# EasyEDA Pro project xiaozhi.epro

# Schematic Schematic1
Board Name: Board1; Create Date: 2025-10-13; Page Name: P1; Project Name: 小智礼物; Schematic Name: Schematic1; Update Date: 2025-10-15; Company: 嘉立创EDA; Page Size: A4; Version: V1.0
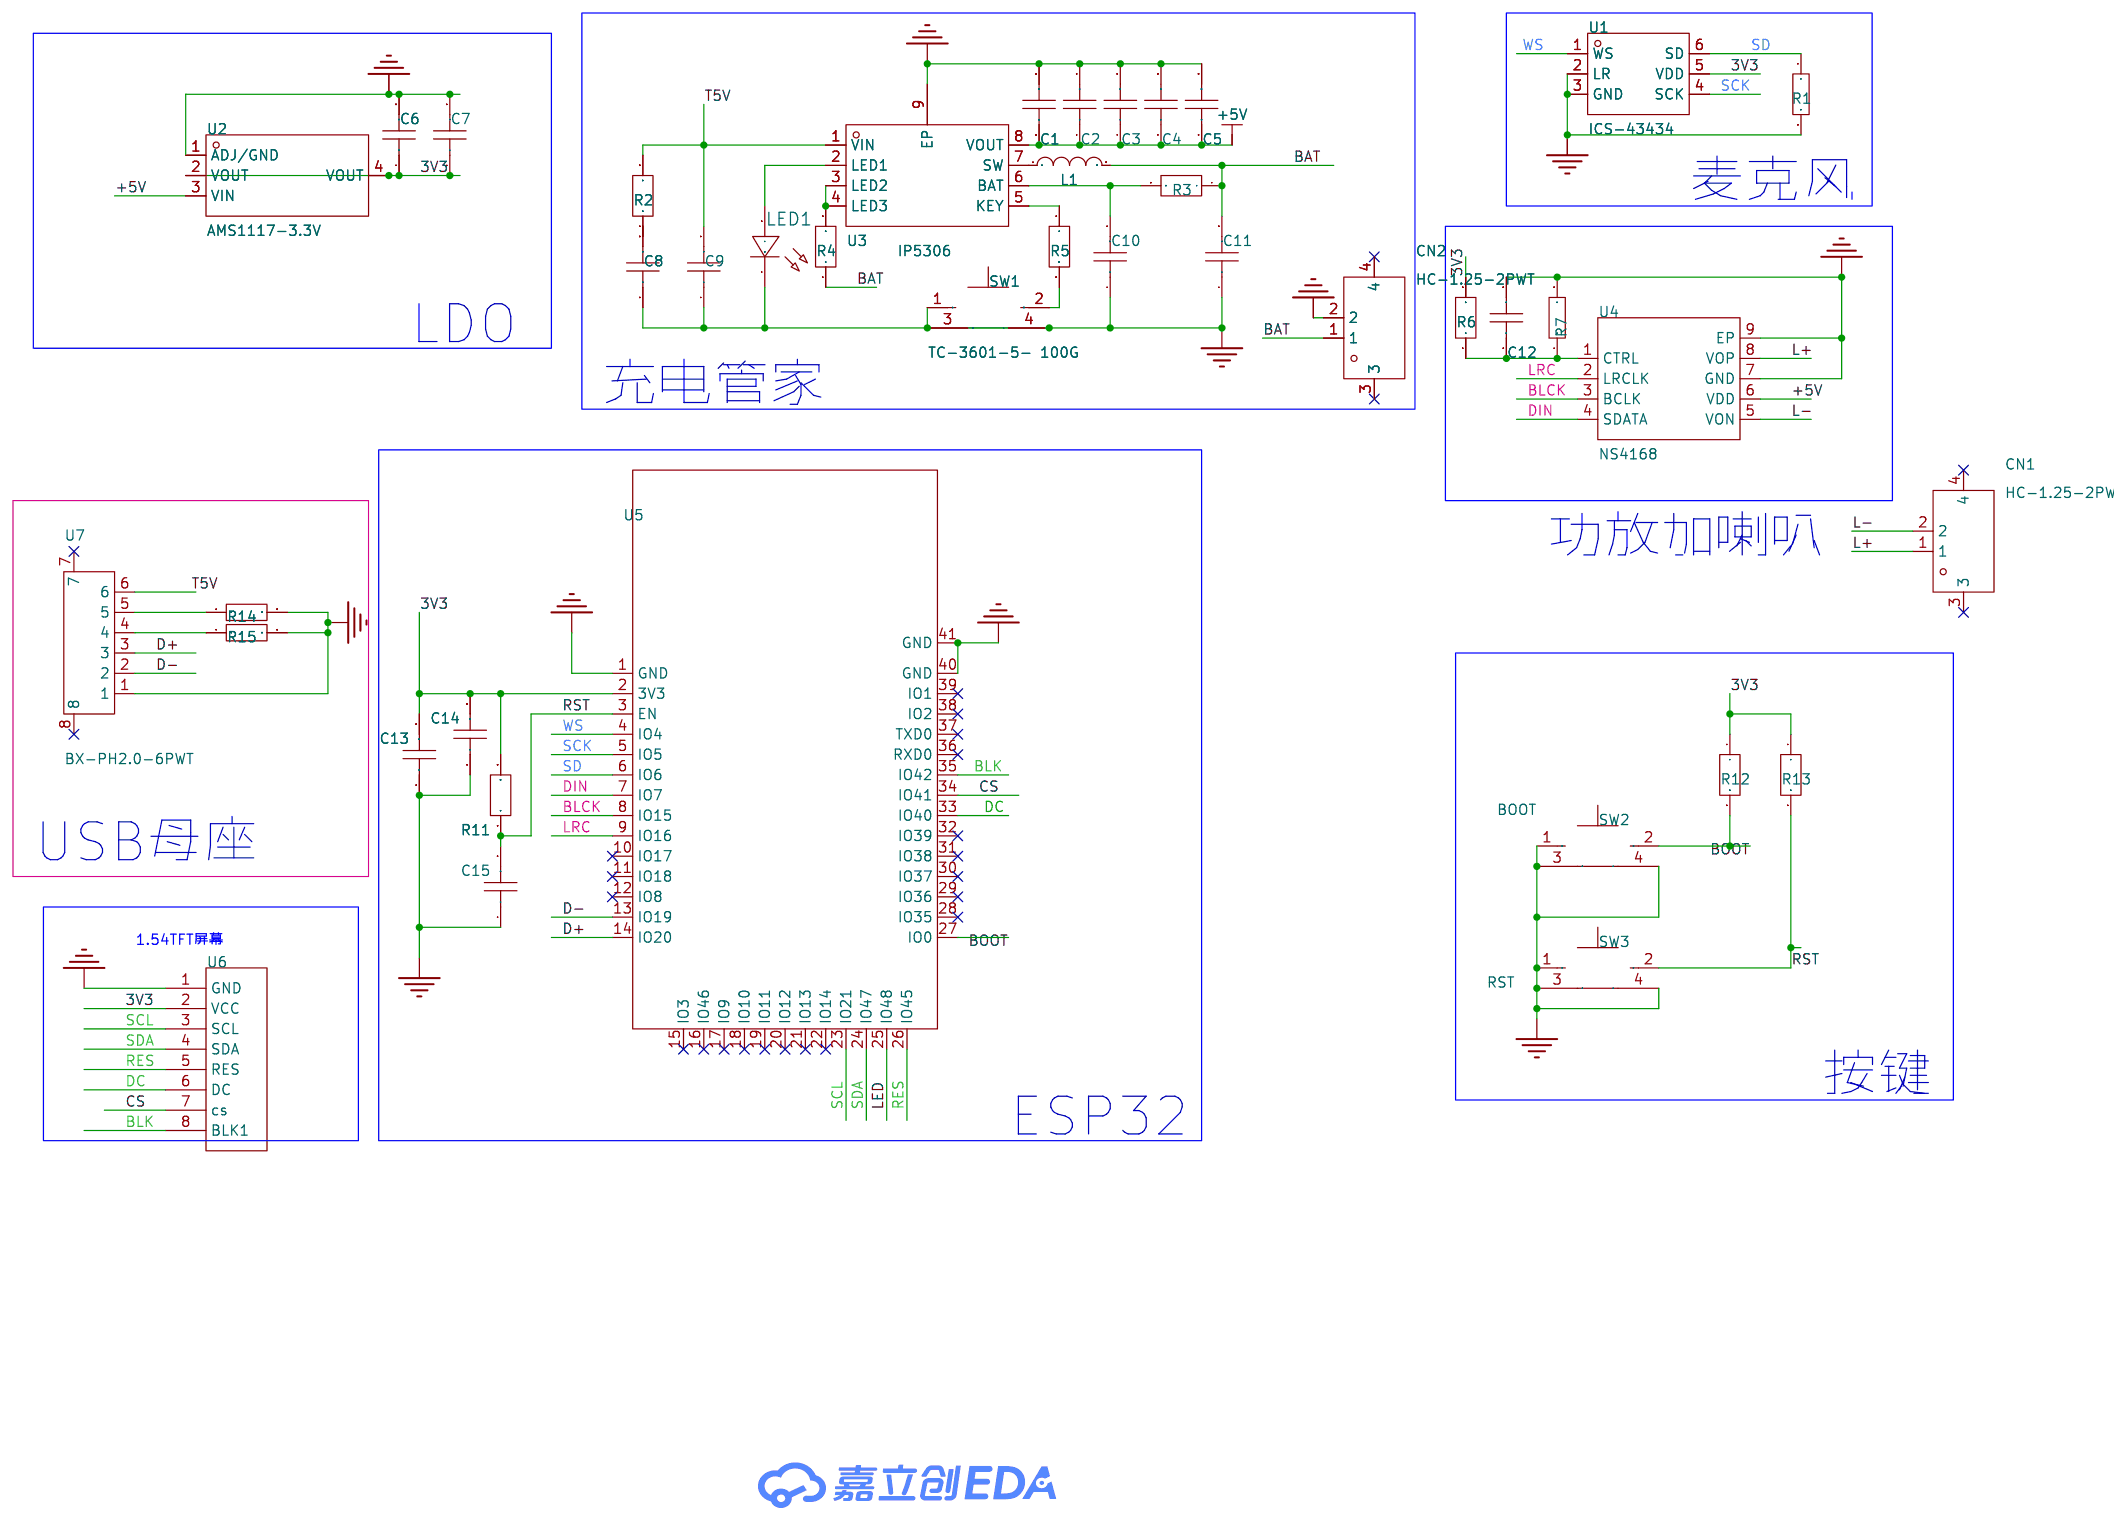
[diagram p0: schematic sheet]

## Parts
C1  22UF  [C0805]
C2  22UF  [C0805]
C3  22UF  [C0805]
C4  22UF  [C0805]
C5  22UF  [C0805]
C6  100NF  [C0805]
C7  10UF  [C0805]
C8  10uF  [C0805]
C9  10uF  [C0805]
C10  22UF  [C0805]
C11  22UF  [C0805]
C12  10UF  [C0805]
C13  10uF  [C0805]
C14  100nF  [C0805]
C15  1uF  [C0805]
CN1  HC-1.25-2PWT  [CONN-SMD_2P-P1.25-HC-1.25-2PWT]
CN2  HC-1.25-2PWT  [CONN-SMD_2P-P1.25-HC-1.25-2PWT]
L1  1uH  [IND-SMD_L4.4-W4.2]
LED1  -  [LED_0805]
R1  100K  [R0805]
R2  2R  [R0805]
R3  500mΩ  [R0805]
R4  1K  [R0805]
R5  10K  [R0805]
R6  10K  [R0805]
R7  5.1kΩ  [R0805]
R11  10K  [R0805]
R12  10K  [R0805]
R13  10K  [R0805]
R14  5.1kΩ  [R0805]
R15  5.1kΩ  [R0805]
SW1  TC-3601-5- 100G  [KEY-TH_TC-3601-5-100G_1]
SW2  BOOT  [KEY-TH_TC-3601-5-100G_1]
SW3  RST  [KEY-TH_TC-3601-5-100G_1]
U1  ICS-43434  [MIC-SMD_6P-L3.5-W2.7-P0.90-BL]
U2  AMS1117-3.3V  [SOT-223-4_L6.5-W3.5-P2.30-LS7.0-TR]
U3  IP5306  [ESOP-8_L4.9-W3.9-P1.27-LS6.0-BL-EP]
U4  NS4168  [ESOP-8_L4.9-W3.9-P1.27-LS6.0-BL-EP]
U5  ESP32-S3-WROOM-1-N16R8  [WIFIM-SMD_ESP32-S3-WROOM-1-N16R8]
U6  -  (no BOM)
U7  BX-PH2.0-6PWT  [CONN-SMD_6P-P2.00_MXPH-2.0-6P-WT1-0-A]

## Library data of the parts
C1-C7 C10-C12 = CAP_0805: Supplier Footprint: 0805
C8 C9 C13-C15 = CGA0805X5R106K250MT: 容值:10uF;精度:±10%;额定电压:25V;温度系数:X5R;; LCSC Part Name: 10uF ±10% 25V; Supplier Part: C6119887; Manufacturer: HRE(芯声); Supplier Footprint: 0805; JLCPCB Part Class: 扩展库; Supplier: LCSC; Tolerance: ±10%; Voltage Rating: 25V; Temperature Coefficient: X5R
CN1 CN2 = HC-1.25-2PWT: 插针结构:1x2P;间距:1.25mm;安装方式:卧贴;参考系列:PicoBlade(MX 1.25);总PIN数:2P;排数:1;每排PIN数:2;行距:-;额定电流:1A;触头材质:黄铜;触头镀层:锡;工作温度范围:-40℃~+105℃;; LCSC Part Name: 1x2P 间距:1.25mm 卧贴 系列:PicoBlade(MX 1.25); Supplier Part: C2845379; Manufacturer: HCTL(华灿天禄); Supplier Footprint: SMD,P=1.25mm,卧贴; JLCPCB Part Class: 扩展库; Datasheet: https://atta.szlcsc.com/upload/public/pdf/source/20240930/9508A8292CCC87B0C29E3A028D56E30A.pdf; Supplier: LCSC; Pins Structure: 1x2P; Pitch: 1.25mm; Mounting Style: 卧贴; Reference Series: PicoBlade(MX 1.25); Number of Pins: 2P; Number of Rows: 1; Number of PINs Per Row: 2; Current Rating (Max): 1A; Contact Material: 黄铜; Contact Plating: 锡; Operating Temperature Range: -40℃~+105℃; Rated Voltage (Max): 125V; Plastic Material: LCP; Flame Retardant Rating: UL94V-0; Supplementary Features: 辅助焊脚; Z-Height of the Board: 3.57mm; X-Length of Bottom Edge on Board (Spacing Line): 7.55mm; Y-Width of Bottom Edge on Board: 5.25mm
L1 = CXP0420-1ROM-AG(1uh): 电感值:1uH;精度:±20%;饱和电流(Isat):7A;类型:一体成型电感;; LCSC Part Name: 1uH ±20% 7A; Supplier Part: C7187305; Manufacturer: DMBJ(振宝佳); Supplier Footprint: SMD,4.2x4.4mm; JLCPCB Part Class: Extended Part; Datasheet: https://atta.szlcsc.com/upload/public/pdf/source/20230710/CFC2BBD551035D908F0C7CBC8304138F.pdf; Supplier: LCSC; Tolerance: ±20%; Saturation Current (Isat): 7A; Type: 一体成型电感
LED1 = LED_0805-R: Supplier Footprint: 0805
R1 = Res_0805: Supplier Footprint: 0805
R2-R6 R11-R13 = FRL0805JR500TS: 电阻类型:厚膜电阻;阻值:500mΩ;精度:±5%;功率:125mW;最大工作电压:300V;温度系数:±300ppm/℃;; LCSC Part Name: 500mΩ ±5% 125mW 厚膜电阻; Supplier Part: C2934281; Manufacturer: FOJAN(富捷); Supplier Footprint: 0805; JLCPCB Part Class: Extended Part; Datasheet: https://atta.szlcsc.com/upload/public/pdf/source/20211221/925EC7D7225764EE0046F22065062C87.pdf; Supplier: LCSC; Type: 厚膜电阻; Tolerance: ±5%; Power(Watts): 125mW; Overload Voltage (Max): 300V; Temperature Coefficient: ±300ppm/℃; Operating Temperature Range: -55℃~+155℃
R7 R14 R15 = 0805W8F5101T5E: 电阻类型:厚膜电阻;阻值:5.1kΩ;精度:±1%;功率:125mW;最大工作电压:150V;温度系数:±100ppm/℃;; LCSC Part Name: 5.1kΩ ±1% 125mW; Supplier Part: C27834; Manufacturer: UNI-ROYAL(厚声); Supplier Footprint: 0805; JLCPCB Part Class: 基础库; Datasheet: https://atta.szlcsc.com/upload/public/pdf/source/20200306/C422600_1E6D84923E4A46A82E41ADD87F860B5C.pdf; Supplier: LCSC; Type: 厚膜电阻; Tolerance: ±1%; Power(Watts): 125mW; Temperature Coefficient: ±100ppm/℃; Overload Voltage (Max): 150V; Operating Temperature Range: -55℃~+155℃
SW1-SW3 = TC-3601-5- 100G: 电路结构:单刀单掷;按钮形状:圆形按钮;作用力:100gf;安装方式:立贴;开关长度:3mm;开关宽度:6mm;开关高度:5mm;带支架:带支架;触点电流:50mA;额定电压(AC):-;额定电压(DC):12V;额定功率:-;绝缘电阻:-;带灯:-;机械寿命:10万次;; LCSC Part Name: 轻触3*6*5支架 插件100G; Supplier Part: C2845280; Manufacturer: HCTL(华灿天禄); Supplier Footprint: 插件; JLCPCB Part Class: 扩展库; Supplier: LCSC; Circuit: 单刀单掷; Actuator Style: 圆形按钮; Operating Force: 100gf; Mounting Style: 立贴; Switch Length: 3mm; Switch Width: 6mm; Switch Height: 5mm; Strike Gundam: 带支架; Contact Current: 50mA; Voltage Rating (DC): 12V; Actuator/Cap Color: 黑色; Pin Style: 鸥翼型; Mechanical Life: 10万次
U1 = ICS-43434_C5656610: 指向性:全指向;信噪比:64dB;灵敏度:-;; Supplier Part: C5656610; Manufacturer: TDK InvenSense(应美盛); JLCPCB Part Class: 扩展库; Datasheet: https://atta.szlcsc.com/upload/public/pdf/source/231023/DS-000069-ICS-43434-v1.2-8194c7772d771e21a553109502704f97.pdf; Supplier: LCSC; Direction: 全指向; Supply Voltage: 1.65V~3.63V; Current Consumption: 550uA; SNR(Signal to Noise Ratio): 64dB
U2 = AMS1117-3.3V_C5120765: 输出类型:固定;最大输入电压:18V;输出电压:3.3V;最大输出电流:1A;输出极性:正极;; LCSC Part Name: 输入18V 输出3.3V 1A; Supplier Part: C5120765; Manufacturer: MSKSEMI(美森科); Supplier Footprint: SOT-223; JLCPCB Part Class: 扩展库; Datasheet: https://atta.szlcsc.com/upload/public/pdf/source/20230802/7000FCAFF33971783A269E7BD69EFE08.pdf; Supplier: LCSC; Output Type: 固定; Maximum Input Voltage: 18V; Output Voltage: 3.3V; MAX Output Current: 1A; Dropout Voltage: 1.4V@(1A); standby current: 12mA; Operating Temperature: 0℃~+125℃; Output Polarity: 正极; Number of Outputs: 1
U3 = IP5306: 2.1A充电2.4A放电高集成度移动电源SOC; Supplier Part: C181692; Manufacturer: INJOINIC(英集芯); Supplier Footprint: ESOP-8; JLCPCB Part Class: 扩展库; Datasheet: https://atta.szlcsc.com/upload/public/pdf/source/20190627/C384572_9925B3DDC4041BC6108E5AB46A2A0AB1.pdf; Supplier: LCSC
U4 = NS4168_C910588: 功放类型:D类功放;输出功率:2.5Wx1@4Ω;; Supplier Part: C910588; Manufacturer: Nsiway(纳芯威); Supplier Footprint: ESOP-8-EP(3.9x4.9x1.27); JLCPCB Part Class: 扩展库; Datasheet: https://atta.szlcsc.com/upload/public/pdf/source/20240722/6A2F478F91F6E02E759B805C93276334.pdf; Supplier: LCSC; Class: D类功放; Output Power: 2.5Wx1@4Ω; Voltage - Supply: 3V~5.5V
U5 = ESP32-S3-WROOM-1-N16R8: LCSC Part Name: 通用型Wi-Fi+低功耗蓝牙MCU模组; Supplier Part: C2913202; Manufacturer: ESPRESSIF(乐鑫); Supplier Footprint: SMD,18x25.5mm; JLCPCB Part Class: Extended Part; Datasheet: https://atta.szlcsc.com/upload/public/pdf/source/20241030/6A412B13087E1327DF6279F5735253CA.pdf; Supplier: LCSC
U6 = TFT1.3液晶屏
U7 = BX-PH2.0-6PWT: 插针结构:1x6P;间距:2mm;安装方式:卧贴;参考系列:PH;总PIN数:6P;排数:1;每排PIN数:6;行距:-;额定电流:2A;触头材质:黄铜;触头镀层:锡;工作温度:-25℃~+85℃;; LCSC Part Name: 1x6P 间距:2mm 卧贴 系列:PH; Supplier Part: C18077894; Manufacturer: Bossie(博锡); Supplier Footprint: SMD,P=2mm,卧贴; JLCPCB Part Class: 扩展库; Datasheet: https://item.szlcsc.com/datasheet/BX-PH2.0-6PWT/19218295.html; Supplier: LCSC; Pins Structure: 1x6P; Pitch: 2mm; Mounting Type: 卧贴; Reference Series: PH; Number of Pins: 6P; Number of Rows: 1; Number of PINs Per Row: 6; Current Rating: 2A; Contact Material: 黄铜; Contact Plating: 锡; Operating Temperature: -25℃~+85℃; Voltage Rating: 250V; Plastic Material: LCP; Supplementary Features: 辅助焊脚; Color: 米色; Z-Height of the Board: 5.6mm; X-Length of Bottom Edge on Board (Spacing Line): 16mm; Y-Width of Bottom Edge on Board: 8.5mm

## Nets
3V3: C6.1 C7.1 C13.2 C14.2 R6.2 R11.2 R12.1 R13.1 U1.5(VDD) U2.2(VOUT) U2.4(VOUT) U5.2(3V3) U6.2(VCC)
+5V: C1.1 C2.1 C3.1 C4.1 C5.1 U2.3(VIN) U3.8(VOUT) U4.6(VDD)
GND: C1.2 C2.2 C3.2 C4.2 C5.2 C6.2 C7.2 C8.1 C9.1 C10.1 C11.1 C12.2 C13.1 C14.1 C15.1 CN2.2 LED1.1(C) R1.2 R7.2 R14.2 R15.2 SW1.1 SW1.3 SW1.4 SW2.1 SW2.3 SW2.4 SW3.1 SW3.3 SW3.4 U1.2(LR) U1.3(GND) U2.1(ADJ/GND) U3.9(EP) U4.7(GND) U4.9(EP) U5.1(GND) U5.40(GND) U5.41(GND) U6.1(GND) U7.1
BAT: C11.2 CN2.1 L1.2 R3.1 R4.1
BLCK: U4.3(BCLK) U5.8(IO15)
BLK: U5.35(IO42) U6.8(BLK1)
BOOT: R12.2 SW2.2 U5.27(IO0)
CS: U5.34(IO41) U6.7(cs)
D+: U5.14(IO20) U7.3
D-: U5.13(IO19) U7.2
DC: U5.33(IO40) U6.6(DC)
DIN: U4.4(SDATA) U5.7(IO7)
L+: CN1.1 U4.8(VOP)
L-: CN1.2 U4.5(VON)
LED: U5.25(IO48)
LRC: U4.2(LRCLK) U5.9(IO16)
RES: U5.26(IO45) U6.5(RES)
RST: C15.2 R11.1 R13.2 SW3.2 U5.3(EN)
SCK: U1.4(SCK) U5.5(IO5)
SCL: U5.23(IO21) U6.3(SCL)
SD: R1.1 U1.6(SD) U5.6(IO6)
SDA: U5.24(IO47) U6.4(SDA)
T5V: C9.2 R2.2 U3.1(VIN) U7.6
WS: U1.1(WS) U5.4(IO4)
$1N1653: LED1.2(A) U3.2(LED1)
$1N1654: L1.1 U3.7(SW)
$1N1684: C12.1 R6.1 R7.1 U4.1(CTRL)
$1N1700: R5.1 U3.5(KEY)
$1N1704: C10.2 R3.2 U3.6(BAT)
$1N1708: C8.2 R2.1
$1N1732: R4.2 U3.3(LED2) U3.4(LED3)
$1N1735: R5.2 SW1.2
$1N6727: R14.1 U7.5
$1N6731: R15.1 U7.4

Not connected (* = marked no-connect by the designer): CN1 3* 4*; CN2 3* 4*; U5 10(IO17)* 11(IO18)* 12(IO8)* 15(IO3)* 16(IO46)* 17(IO9)* 18(IO10)* 19(IO11)* 20(IO12)* 21(IO13)* 22(IO14)* 28(IO35)* 29(IO36)* 30(IO37)* 31(IO38)* 32(IO39)* 36(RXD0)* 37(TXD0)* 38(IO2)* 39(IO1)*; U7 7* 8*

## Notes on the sheet
- 麦克风
- LDO
- 充电管家
- 功放加喇叭
- USB母座
- 1.54TFT屏幕
- 按键
- ESP32

# Board PCB1
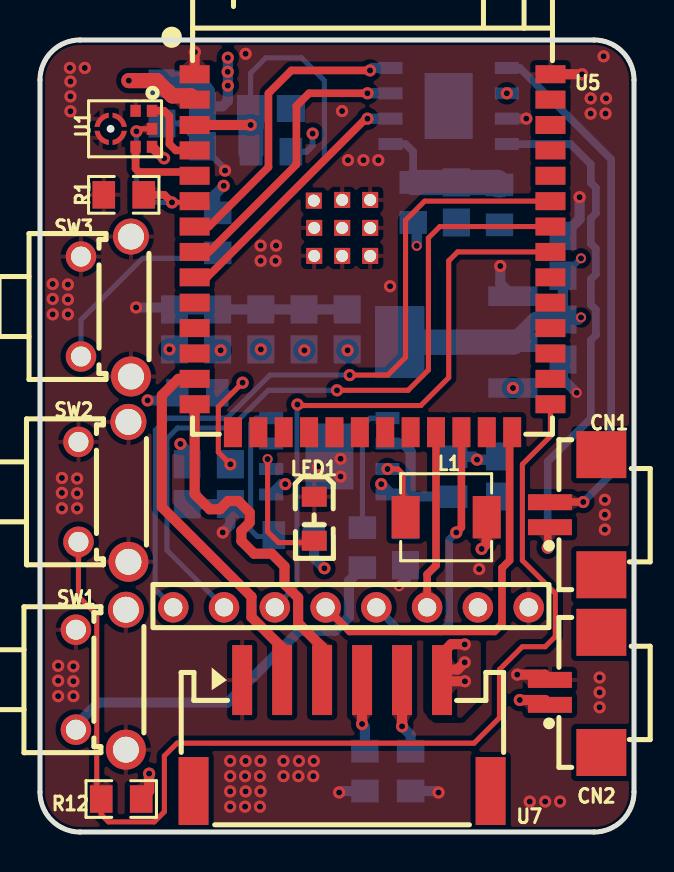
[diagram p1: board, top side]
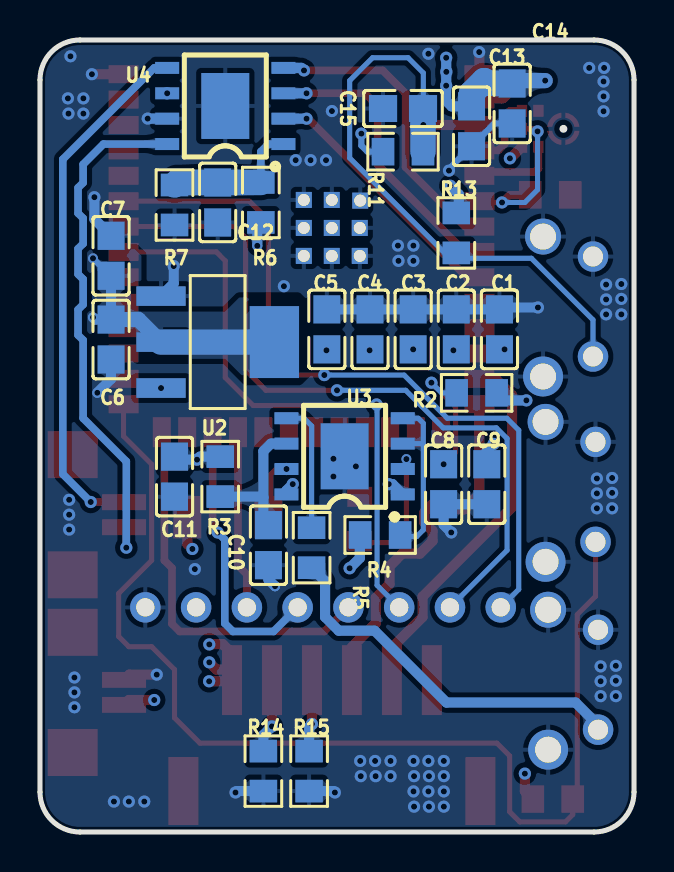
[diagram p2: board, bottom side, seen from below]

Outline 29.72 x 39.62 mm; copper layers: Top Layer, Inner1, 内层2, Bottom Layer. Coordinates in mm from the lower left corner of the outline.
Outline path: 0,37.62 0,2 arc(0.59,0.59) 2,0 27.72,0 arc(29.13,0.59) 29.72,2 29.72,37.62 arc(29.13,39.04) 27.72,39.62 2,39.62 arc(0.59,39.04) 0,37.62
Stack: Top Layer 0.035mm 外层铜厚1oz / Dielectric1 0.2104mm 7628 RC49% 8.6mil / Inner1 0.0152mm 内层铜厚 / Dielectric2 1.065mm 1.1mm H/HOZ Copper / 内层2 0.0152mm 内层铜厚 / Dielectric3 0.2104mm 7628 RC49% 8.6mil / Bottom Layer 0.035mm 外层铜厚1oz

## Design rules (mm)
net L-: DP1
net L+: DP1
net D-: DP2
net D+: DP2
template: 自定义配置
spacing copperThickness1oz (default): track to track 0.102, other pairs 0.152 to 0.3
spacing copperThickness2oz: track to track 0.203, other pairs 0.152 to 0.3
track width copperThickness1oz (default): min 0.127, default 0.254, max 2.54
track width copperThickness2oz: min 0.203, default 0.254, max 2.54
differential pair differentialPair (default): width min 0.127, default 0.254, max 2.54; gap min 0.152, default 0.152
via viaSize (default): diameter min 0.5, default 0.61, max 10; hole min 0.3, default 0.305, max 6.3

## Placement (name value [footprint] x y rotation side)
C1  22UF  [C0805]  6.73 25.15 90 bottom
C2  22UF  [C0805]  8.89 25.15 90 bottom
C3  22UF  [C0805]  11.05 25.15 90 bottom
C4  22UF  [C0805]  13.21 25.15 90 bottom
C5  22UF  [C0805]  15.37 25.15 90 bottom
C6  100NF  [C0805]  26.16 24.64 270 bottom
C7  10UF  [C0805]  26.16 28.83 90 bottom
C8  10uF  [C0805]  9.53 17.4 90 bottom
C9  10uF  [C0805]  7.37 17.4 90 bottom
C10  22UF  [C0805]  18.29 14.35 90 bottom
C11  22UF  [C0805]  22.99 17.78 90 bottom
C12  10UF  [C0805]  20.83 31.5 270 bottom
C13  10uF  [C0805]  8.13 35.31 90 bottom
C14  100nF  [C0805]  6.1 36.45 90 bottom
C15  1uF  [C0805]  11.56 36.19 180 bottom
CN1  HC-1.25-2PWT  [CONN-SMD_2P-P1.25-HC-1.25-2PWT]  26.8 15.88 90 top
CN2  HC-1.25-2PWT  [CONN-SMD_2P-P1.25-HC-1.25-2PWT]  26.8 6.98 90 top
L1  1uH  [IND-SMD_L4.4-W4.2]  20.32 15.75 180 top
LED1  -  [LED_0805]  13.72 15.62 270 top
NOREF  -  [Pad_e56]  21.91 11.24 180 top
NOREF#2  -  [Pad_e61]  9.21 11.24 180 top
NOREF#3  -  [Pad_e59]  14.29 11.24 180 top
NOREF#4  -  [Pad_e60]  11.75 11.24 180 top
NOREF#5  -  [Pad_e55]  24.45 11.24 180 top
NOREF#6  -  [Pad_e62]  6.67 11.24 180 top
NOREF#7  -  [Pad_e57]  19.37 11.24 180 top
NOREF#8  -  [Pad_e58]  16.83 11.24 180 top
R1  100K  [R0805]  4.19 31.88 180 top
R2  2R  [R0805]  7.87 21.97 180 bottom
R3  500mΩ  [R0805]  20.7 17.78 270 bottom
R4  1K  [R0805]  12.7 14.86 180 bottom
R5  10K  [R0805]  16.13 14.22 270 bottom
R6  10K  [R0805]  18.67 31.5 270 bottom
R7  5.1kΩ  [R0805]  22.99 31.37 270 bottom
R11  10K  [R0805]  11.56 34.04 0 bottom
R12  10K  [R0805]  4.06 1.65 180 top
R13  10K  [R0805]  8.89 29.97 270 bottom
R14  5.1kΩ  [R0805]  18.54 3.05 270 bottom
R15  5.1kΩ  [R0805]  16.26 3.05 270 bottom
SW1  TC-3601-5- 100G  [KEY-TH_TC-3601-5-100G_1]  3.05 7.62 270 top
SW2  BOOT  [KEY-TH_TC-3601-5-100G_1]  3.18 17.02 270 top
SW3  RST  [KEY-TH_TC-3601-5-100G_1]  3.3 26.29 270 top
U1  ICS-43434  [MIC-SMD_6P-L3.5-W2.7-P0.90-BL]  4.32 35.18 180 top
U2  AMS1117-3.3V  [SOT-223-4_L6.5-W3.5-P2.30-LS7.0-TR]  20.83 24.51 270 bottom
U3  IP5306  [ESOP-8_L4.9-W3.9-P1.27-LS6.0-BL-EP]  14.48 18.8 90 bottom
U4  NS4168  [ESOP-8_L4.9-W3.9-P1.27-LS6.0-BL-EP]  20.45 36.32 90 bottom
U5  ESP32-S3-WROOM-1-N16R8  [WIFIM-SMD_ESP32-S3-WROOM-1-N16R8]  16.64 28.96 0 top
U7  BX-PH2.0-6PWT  [CONN-SMD_6P-P2.00_MXPH-2.0-6P-WT1-0-A]  15.11 4.83 0 top

## Footprints (pads in the part's own frame, mm; a bottom-side part is the same pattern mirrored in y, then rotated)
C0805
  rect 1.41x1.35 smd: 1(-1,0) 2(1,0)
CONN-SMD_2P-P1.25-HC-1.25-2PWT
  rect 0.8x2.2 smd: 1(-0.625,1.285) 2(0.625,1.285)
  rect 2.35x2.5 smd: 3(-3.005,-1.285) 4(3.005,-1.285)
CONN-SMD_6P-P2.00_MXPH-2.0-6P-WT1-0-A
  rect 1x3.5 smd: 1(-5,2.775) 2(-3,2.775) 3(-1,2.775) 4(1,2.775) 5(3,2.775) 6(5,2.775)
  rect 1.5x3.4 smd: 7(7.43,-2.775) 8(-7.43,-2.775)
ESOP-8_L4.9-W3.9-P1.27-LS6.0-BL-EP
  rect 0.6x1.2 smd: 1(-1.905,-2.909) 2(-0.635,-2.909) 3(0.635,-2.909) 4(1.905,-2.909) 5(1.905,2.909) 6(0.635,2.909) 7(-0.635,2.909) 8(-1.905,2.909)
  rect 3.3x2.4 smd: 9(0,0)
IND-SMD_L4.4-W4.2
  rect 1.4x2.12 smd: 1(2.028,0) 2(-2.028,0)
KEY-TH_TC-3601-5-100G_1
  round 1.524 hole 1: 1(-2.5,-1.25) 2(2.5,-1.25)
  round 1.8 hole 1.3: 3(-3.5,1.25)
  round 2 hole 1.3: 4(3.5,1.25)
LED_0805
  rect 1x1.25 smd: 1(-1.15,0.005) 2(1.05,0.005)
MIC-SMD_6P-L3.5-W2.7-P0.90-BL
  rect 0.52x0.6 smd: 1(-1.286,-0.9) 2(-0.465,-0.9) 4(-0.465,0.9) 5(-1.286,0.9) 6(-1.286,0)
  custom 0.709x0.71 smd: 3(0.276,-0.452) 3(0.329,0.505) 3(1.234,-0.505) 3(1.286,0.452)
Pad_e55
  round 1.524 hole 0.914: 1(0,0)
Pad_e56
  round 1.524 hole 0.914: 2(0,0)
Pad_e57
  round 1.524 hole 0.914: 3(0,0)
Pad_e58
  round 1.524 hole 0.914: 4(0,0)
Pad_e59
  round 1.524 hole 0.914: 5(0,0)
Pad_e60
  round 1.524 hole 0.914: 6(0,0)
Pad_e61
  round 1.524 hole 0.914: 7(0,0)
Pad_e62
  round 1.524 hole 0.914: 8(0,0)
R0805
  rect 1.133x1.377 smd: 1(-1,0) 2(1,0)
SOT-223-4_L6.5-W3.5-P2.30-LS7.0-TR
  rect 0.98x2.47 smd: 1(-2.3,-2.835) 2(0,-2.835) 3(2.3,-2.835)
  rect 3.6x2.47 smd: 4(0,2.835)
WIFIM-SMD_ESP32-S3-WROOM-1-N16R8
  rect 1.5x0.9 smd: 1(-8.9,8.954) 2(-8.9,7.684) 3(-8.9,6.415) 4(-8.9,5.144) 5(-8.9,3.874) 6(-8.9,2.604) 7(-8.9,1.335) 8(-8.9,0.065) 9(-8.9,-1.206) 10(-8.9,-2.475) 11(-8.9,-3.745) 12(-8.9,-5.016) 13(-8.9,-6.285) 14(-8.9,-7.556) 27(8.9,-7.556) 28(8.9,-6.285) 29(8.9,-5.016) 30(8.9,-3.745) 31(8.9,-2.475) 32(8.9,-1.206) 33(8.9,0.065) 34(8.9,1.335) 35(8.9,2.604) 36(8.9,3.874) 37(8.9,5.144) 38(8.9,6.415) 39(8.9,7.684) 40(8.9,8.954)
  rect 0.9x1.5 smd: 15(-6.985,-8.954) 16(-5.715,-8.954) 17(-4.445,-8.954) 18(-3.175,-8.954) 19(-1.905,-8.954) 20(-0.635,-8.954) 21(0.635,-8.954) 22(1.905,-8.954) 23(3.175,-8.954) 24(4.445,-8.954) 25(5.715,-8.954) 26(6.985,-8.954)
  rect 0.8x0.8 hole 0.6: 41(-2.939,2.631) 41(-2.918,1.266) 41(-2.918,-0.135) 41(-1.518,2.666) 41(-1.518,1.266) 41(-1.518,-0.135) 41(-0.118,2.666) 41(-0.118,1.266) 41(-0.118,-0.135)

## Nets
3V3: C6.1 C7.1 C13.2 C14.2 NOREF.2 R6.2 R11.2 R12.1 R13.1 U1.5 U2.2 U2.4 U5.2
+5V: C1.1 C2.1 C3.1 C4.1 C5.1 U2.3 U3.8 U4.6
GND: C1.2 C2.2 C3.2 C4.2 C5.2 C6.2 C7.2 C8.1 C9.1 C10.1 C11.1 C12.2 C13.1 C14.1 C15.1 CN2.2 LED1.1 NOREF#5.1 R1.2 R7.2 R14.2 R15.2 SW1.1 SW1.3 SW1.4 SW2.1 SW2.3 SW2.4 SW3.1 SW3.3 SW3.4 U1.2 U1.3 U2.1 U3.9 U4.7 U4.9 U5.1 U5.40 U5.41 U7.1
BAT: C11.2 CN2.1 L1.2 R3.1 R4.1
BLCK: U4.3 U5.8
BLK: NOREF#6.8 U5.35
BOOT: R12.2 SW2.2 U5.27
CS: NOREF#2.7 U5.34
D+: U5.14 U7.3
D-: U5.13 U7.2
DC: NOREF#4.6 U5.33
DIN: U4.4 U5.7
L+: CN1.1 U4.8
L-: CN1.2 U4.5
LED: U5.25
LRC: U4.2 U5.9
RES: NOREF#3.5 U5.26
RST: C15.2 R11.1 R13.2 SW3.2 U5.3
SCK: U1.4 U5.5
SCL: NOREF#7.3 U5.23
SD: R1.1 U1.6 U5.6
SDA: NOREF#8.4 U5.24
T5V: C9.2 R2.2 U3.1 U7.6
WS: U1.1 U5.4
$1N1653: LED1.2 U3.2
$1N1654: L1.1 U3.7
$1N1684: C12.1 R6.1 R7.1 U4.1
$1N1700: R5.1 U3.5
$1N1704: C10.2 R3.2 U3.6
$1N1708: C8.2 R2.1
$1N1732: R4.2 U3.3 U3.4
$1N1735: R5.2 SW1.2
$1N6727: R14.1 U7.5
$1N6731: R15.1 U7.4

Pads without a net: CN1 3 4; CN2 3 4; U5 10 11 12 15 16 17 18 19 20 21 22 28 29 30 31 32 36 37 38 39; U7 7 8

## Via types
v1: diameter 0.61, hole 0.305, Top Layer to Bottom Layer, 123 vias
v2: diameter 0.5, hole 0.3, Top Layer to Bottom Layer, 2 vias
v3: diameter 0.5, hole 0.305, Top Layer to Bottom Layer, 4 vias

## Routing (per net, layer and track width the routed paths; a pad name or vN(x,y) marks a point on that pad's centre or on a via; arc(x,y) is an arc through that point)
3V3: length 31.8
  Top Layer w0.508: U1.5 6.15,33.73 ; R12.1 5.46,2.05 v1(5.46,2.92)
  Top Layer w0.762: v1(4.45,37.59) 5.84,37.59 6.37,37.06 6.38,37.06 6.61,36.83 7.55,36.83 7.74,36.64
  Bottom Layer w0.305: R11.2 13.34,34.04 13.64,34.34 v1(13.64,34.94) ; v3(27.07,28.7) 26.19,27.83 C7.1
  Bottom Layer w0.508: C7.1 C6.1 26.96,25.64 v3(27.07,25.74) ; C13.2 9.13,36.31 9.4,36.58 v1(9.4,37.34) v1(9.4,38.73) ; v1(9.19,32.33) 8.76,31.9 8.76,31.1 R13.1 ; v3(18.85,29.33) 18.85,30.32 R6.2
  Bottom Layer w0.762: v1(4.45,37.59) 5.95,37.59 C14.2 ; U2.2 24.79,25.64 C6.1
  Bottom Layer w1.27: C13.2 8.13,36.96 7.49,37.59 7.36,37.46 6.09,37.46 ; U2.4 U2.2
  vias: v1(6.21,33.7) v1(9.39,38.03)
+5V: length 0.6
  Bottom Layer w0.508: v1(17.07,17.4) 17.39,17.09 U3.8
  vias: v1(6.48,24.15) v1(9.04,24.1) v1(11.05,24.15) v1(13.23,24.1) v1(15.39,24.1) v1(23.36,36.96) v1(23.66,22.21)
GND: length 33.9
  Top Layer w0.508: U5.40 v1(27.12,37.91) ; U5.1 7.74,39.01 v1(7.75,39.02) ; CN2.2 25.25,7.87 v1(23.88,7.87)
  Bottom Layer w0.305: v1(9.26,33.09) 9.26,33.18 C13.1 6.99,35.45 C14.1
  Bottom Layer w0.508: v2(26.85,21.97) 26.16,22.66 C6.2 ; v1(4.81,26.24) 6.64,26.24 C1.2 C2.2 C3.2 C4.2 C5.2 ; v1(9.14,14.99) 9.53,15.37 C8.1 C9.1 ; v1(14.97,1.98) 15.04,2.05 R15.2 ; v1(19.94,1.98) 19.87,2.05 R14.2 ; v1(24.33,35.69) 24.33,35.69 U4.7 ; v1(27,31.76) 27,30.66 C7.2 ; v1(23.03,28.31) 23.03,27.45 U2.1 ; v2(17.96,12.3) 18.29,12.62 C10.1
  vias: v1(0.64,27.42) v1(0.64,26.67) v1(0.64,25.9) v1(0.91,8.31) v1(0.91,7.57) v1(0.91,6.8) v1(1.1,17.71) v1(1.1,16.97) v1(1.1,16.19) v1(1.4,27.39) v1(1.4,26.64) v1(1.4,25.9) v1(1.5,38.23) v1(1.52,37.55) v1(1.52,36.8) v1(1.52,36.06) v1(1.67,8.29) v1(1.67,7.54) v1(1.67,6.8) v1(1.86,17.69) v1(1.86,16.94) v1(1.86,16.19) v1(2.24,38.23) v1(9.51,3.56) v1(9.51,2.79) v1(9.51,2.03) v1(9.51,1.27) v1(10.26,2.79) v1(10.26,1.27) v1(10.29,38.93) v1(10.29,3.56) v1(10.29,2.03) v1(11.04,29.34) v1(11.04,28.58) v1(11.03,3.56) v1(11,2.79) v1(11.03,2.03) v1(11,1.27) v1(11.81,29.34) v1(11.78,28.58) v1(12.18,3.56) v1(12.18,2.79) v1(12.95,3.56) v1(12.93,2.79) v1(13.67,2.79) v1(13.7,3.56) v1(13.92,18.29) v1(15.04,18.67) v1(15.04,17.78) v1(15.11,36.07) v1(15.41,33.61) v1(16.18,33.61) v1(16.93,33.61) v1(17.52,27.3) v1(21.97,13.15) v1(24.5,1.52) v1(25.27,1.52) v1(26.02,1.52) v1(27.55,36.7) v1(27.55,35.94) v1(28,7.73) v1(28,6.98) v1(28,6.24) v1(28.19,38.81) v1(28.26,16.62) v1(28.26,15.88) v1(28.26,15.13) v1(28.32,36.7) v1(28.29,35.94)
BAT: length 7.6
  Top Layer w0.508: CN2.1 25.27,6.6 v1(24,6.6) ; v1(22.09,14.16) 22.35,14.42 L1.2
  Bottom Layer w0.508: R3.1 21.71,18.78 v1(21.86,18.63) 22.84,18.63 C11.2 ; v1(14.23,13.19) 13.72,13.71 13.72,14.84 R4.1
BLCK: length 14.8
  Top Layer w0.381: U5.8 8.46,29.02 12.83,33.39 12.83,36.32 13.46,36.96 v1(16.38,36.96)
  Bottom Layer w0.508: v1(16.38,36.96) 17.54,36.96
BLK: length 37.8
  Top Layer w0.254: U5.35 19.24,31.56 18.29,30.61 18.29,23.75 17.4,22.86 v1(15.49,22.86)
  Bottom Layer w0.254: NOREF#6.8 5.77,12.14 5.77,20.1 6.37,20.7 9.34,20.7 11.5,22.86 v1(15.49,22.86)
BOOT: length 56.8
  Top Layer w0.254: SW2.2 1.93,11.79 2.84,10.88 2.84,1.88 R12.2 3.06,0.87 3.43,0.51 5.72,0.51 6.22,1.02 6.22,3.81 6.86,4.44 21.72,4.44 22.99,5.72 22.99,8.13 24.13,9.27 25.27,9.27 25.78,9.78 25.78,11.94 24.13,13.59 24.13,18.4 25.54,19.8 U5.27
CS: length 37.1
  Top Layer w0.254: v1(14.86,22.1) 18.42,22.1 19.43,23.11 19.43,29.72 20,30.29 U5.34
  Bottom Layer w0.254: NOREF#2.7 6.35,14.1 6.35,19.69 6.88,20.22 9.54,20.22 11.42,22.1 v1(14.86,22.1)
D+: length 18.7
  Top Layer w0.508: U5.14 7.74,16.9 8.49,16.15 9,16.15 9.41,16.56 9.92,16.56 10.49,15.99 10.49,15.48 10.08,15.07 10.08,14.56 10.71,13.92 11.6,13.92 12.23,13.29 12.23,12.41 12.92,11.72 12.92,10.45 14.11,9.25 U7.3
D-: length 18.7
  Top Layer w0.508: U7.2 12.11,9.22 10.58,10.76 10.58,11.77 6.1,16.26 6.1,21.84 6.92,22.67 U5.13
DC: length 29.9
  Top Layer w0.254: U5.33 20.89,29.02 20.45,28.58 20.45,22.73 19.05,21.34 12.93,21.34 v1(12.88,21.39)
  Bottom Layer w0.254: NOREF#4.6 12.85,12.35 12.85,21.36 v1(12.88,21.39)
DIN: length 15.3
  Top Layer w0.381: v1(16.51,38.1) 12.57,38.1 11.43,36.96 11.43,33.27 8.46,30.29 U5.7
  Bottom Layer w0.508: U4.4 16.64,38.23 v1(16.51,38.1)
L+: length 26.4
  Top Layer w0.381: CN1.1 25.4,15.14 v1(25.4,14.22)
  Bottom Layer w0.381: v1(25.4,14.22) 25.4,18.54 27.56,20.7 27.56,24.61 27.81,24.86 27.81,26.13 27.56,26.39 27.56,27.66 27.81,27.91 27.81,29.18 27.56,29.43 27.56,30.7 27.81,30.96 27.81,32.23 27.56,32.48 27.56,33.4 26.54,34.42 U4.8
L-: length 26.5
  Top Layer w0.381: CN1.2 25.52,16.51 v1(27.18,16.51)
  Bottom Layer w0.381: U4.5 24,38.23 28.58,33.66 28.58,17.91 v1(27.18,16.51)
LRC: length 13.1
  Top Layer w0.381: v1(16.38,35.69) 16.3,35.69 8.36,27.75 U5.9
  Bottom Layer w0.508: v1(16.38,35.69) U4.2
RES: length 19.3
  Top Layer w0.381: U5.26 23.5,19.87 23.5,13.59 23.11,13.21 23.11,10.41 22.73,10.03 15.49,10.03 NOREF#3.5
RST: length 32.6
  Top Layer w0.508: U5.3 v1(10.54,35.37)
  Bottom Layer w0.254: C15.2 10.54,36.21 10.54,37.97 11.3,38.73 13.08,38.73 14.22,37.59 14.22,33.72 9.48,28.97 R13.2 8.62,28.7 5.13,28.7 2.05,25.62 SW3.2 ; 10.67,35.24 10.56,35.35
  Bottom Layer w0.508: 10.56,35.35 v1(10.54,35.37)
  Bottom Layer w1.27: C15.2 R11.1
SCK: length 4.2
  Top Layer w0.381: U5.5 7.55,33.02 4.95,33.02 4.78,33.19 U1.4
SCL: length 8.9
  Top Layer w0.381: NOREF#7.3 19.37,12.89 19.81,13.33 19.81,20
SD: length 8.5
  Top Layer w0.254: v1(6.6,31.5) 7.67,31.5 U5.6 ; v1(4.83,35.05) 4.95,35.18 U1.6
  Top Layer w0.381: R1.1 6.22,31.88 v1(6.6,31.5)
  Bottom Layer w0.254: v1(4.83,35.05) 4.83,32.13 5.46,31.5 v1(6.6,31.5)
SDA: length 14.1
  Top Layer w0.381: v1(20.83,14.99) 21.08,15.24 U5.24
  Bottom Layer w0.381: v1(20.83,14.99) 20.47,14.63 20.47,10.44 20.07,10.03 18.03,10.03 NOREF#8.4
T5V: length 8.6
  Top Layer w0.508: v1(21.25,8.49) 20.89,8.13 20.34,8.13 20.11,7.9 20.11,8.94 20.57,9.4 21.24,9.4 v1(21.25,9.39) ; v1(21.26,7.54) 20.17,7.54 U7.6
  Bottom Layer w0.508: v1(7.03,19.42) 7.37,19.08 C9.2 ; R2.2 6.5,21.59 v1(5.39,21.59) ; U3.1 12.08,17.4 v1(12.27,17.4)
WS: length 3.8
  Top Layer w0.381: U1.1 6.21,36.08 6.48,35.81 6.48,34.42 6.79,34.1 U5.4
$1N1653: length 6.8
  Top Layer w0.254: v3(11.39,18.66) 11.39,15.03 11.94,14.48 13.63,14.48 LED1.2
  Bottom Layer w0.254: U3.2 11.39,18.34 v3(11.39,18.66)
$1N1654: length 3.1
  Top Layer w0.254: v1(17.39,18.16) 17.91,18.16 18.16,17.91 18.16,15.88 L1.1
$1N1684: length 7.2
  Bottom Layer w0.381: U4.1 18.29,34.42 18.67,34.04 R6.1
  Bottom Layer w1.27: R7.1 22.86,32.5 C12.1 R6.1
$1N1700: length 6.5
  Bottom Layer w0.254: 17.39,20.7 16.51,20.7 16.13,20.32 R5.1
$1N1704: length 7.3
  Bottom Layer w0.508: R3.2 18.58,16.78 18.54,16.74 ; U3.6 18.16,19.43 18.54,19.05 18.54,16.74 ; 18.54,16.74 18.54,15.61 C10.2
$1N1708: length 6.3
  Top Layer w0.254: v1(10.14,22.48) 8.92,21.27 8.92,19 v1(9.53,18.4)
  Bottom Layer w0.254: v1(10.14,22.48) 9.63,21.97 R2.1
$1N1732: length 8.8
  Bottom Layer w0.254: U3.3 10.57,19.43 10.54,19.4 ; 10.54,19.4 10.54,20.45 10.8,20.7 11.57,20.7 ; 10.54,19.4 10.54,15.11 10.87,14.78 11.63,14.78 R4.2
$1N1735: length 18.9
  Bottom Layer w0.508: SW1.2 1.8,5.35 2.92,6.48 9.38,6.48 12.98,10.07 14.77,10.07 15.46,10.76 15.46,12.55 R5.2
$1N6727: length 3.7
  Top Layer w0.508: U7.5 v1(18.11,5.28)
  Bottom Layer w0.508: v1(18.11,5.28) 18.54,4.86 R14.1
$1N6731: length 3.6
  Top Layer w0.508: U7.4 v1(16.11,5.4)
  Bottom Layer w0.508: v1(16.11,5.4) 16.26,5.26 R15.1

## Copper pours and planes (outline as drawn; the poured copper is in the pictures)
3V3 on Bottom Layer: 24.64,26.03 20.46,26.03 19.75,26.74 16.84,26.74 16.38,26.29 16.38,22.99 16.76,22.61 19.38,22.61 20.45,23.67 24.82,23.67 25.21,24.07 25.21,24.45 25.53,24.77 27.31,24.77 27.94,25.4 27.94,28.66 27.34,29.15 24.95,29.15 24.64,28.84
3V3 on 内层2: 0.26,39.37 29.46,39.37 29.46,0.26 0.26,0.26
+5V on 内层2: 5.33,37.27 25.22,37.27 25.22,16.67 5.33,16.67
GND on Top Layer: -3.3,46.36 33.4,46.36 33.4,-3.56 -3.3,-3.56
GND on Bottom Layer: -5.21,44.07 35.56,44.07 35.56,-4.32 -5.21,-4.32
GND on Inner1: 0.26,39.37 29.46,39.37 29.46,0.26 0.26,0.26
BAT on 内层2: 12.77,18.89 26.09,18.89 26.09,5.63 12.77,5.63
T5V on Top Layer: 19.81,5.72 21.08,5.72 22.06,6.69 22.06,9.46 21.48,10.03 20.07,10.03 19.43,9.4 19.43,6.12 19.81,5.74
T5V on 内层2: 5.02,21.83 21.64,21.83 21.64,5.65 5.02,5.65

Small or netless copper shapes (teardrops, artwork), in the pictures only: 51 on Top Layer, 104 on Bottom Layer, 72 on Inner1, 4 on 内层2
